# EAGLE design lt1619-breakout (EAGLE 6.2)
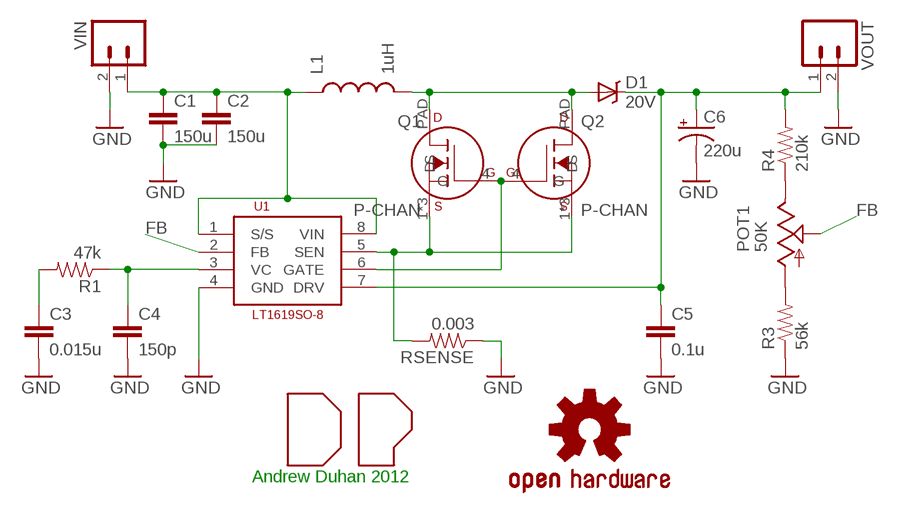
[diagram p0: schematic, sheet 1]

## Parts
C1  150u  CAP1210  [1210]
C2  150u  CAP1210  [1210]
C3  0.015u  CAP0603-CAP  [0603-CAP]
C4  150p  CAP0603-CAP  [0603-CAP]
C5  0.1u  CAP0603-CAP  [0603-CAP]
C6  220u  CAP_POL7343  [EIA7343]
D1  20V  SCHOTTKYDO214AB  [DO-214AB]
L1  1uH  INDUCTOR-SMD-MED4  [INDUCTOR_10.9X10.0]
POT1  50K  POT3310Y-001  [POT-TOP-BOURNS]
Q1  P-CHAN  MOSFET_NP-S08  [LFPAK]
Q2  P-CHAN  MOSFET_NP-S08  [LFPAK]
R1  47k  RESISTOR0603-RES  [0603-RES]
R3  56k  RESISTOR0603-RES  [0603-RES]
R4  210k  RESISTOR0603-RES  [0603-RES]
RSENSE  0.003  RESISTOR1206  [1206]
U1  LT1619SO-8  [SOIC-08]
U$2  DP_LOGO  [DP_LOGO]
U$4  OSHW-LOGOM  [OSHW-LOGO-M]
VIN  M02PTH  [1X02]
VOUT  M02PTH  [1X02]

## Nets
DRAIN: D1.A L1.P$2 Q1.PAD(D) Q2.PAD(D)
FB: POT1.2(W) U1.2(FB)
GATE: Q1.4(G) Q2.4(G) U1.6(GATE)
GND: C1.2 C2.2 C3.2 C4.2 C5.2 C6.C(-) R3.1 RSENSE.1 U1.4(GND) VIN.2 VOUT.2
N$1: C3.1 R1.2
N$2: POT1.3(B) R4.1
N$5: C4.1 R1.1 U1.3(VC)
N$8: POT1.1(A) R3.2
SOURCE: Q1.1(S) Q1.2(S) Q1.3(S) Q2.1(S) Q2.2(S) Q2.3(S) RSENSE.2 U1.5(SEN)
VBATT: C1.1 C2.1 L1.P$1 U1.1(S/S) U1.8(VIN) VIN.1
VOUT: C5.1 C6.A(+) D1.C R4.2 U1.7(DRV) VOUT.1

## Notes on the sheet
- Andrew Duhan 2012

## Library data of the parts
C1 C2 = SparkFun-Passives:CAP: Capacitor Standard 0603 ceramic capacitor, and 0.1" leaded capacitor.
C3-C5 = SparkFun:CAP: Capacitor Standard 0603 ceramic capacitor, and 0.1" leaded capacitor.
C6 = SparkFun-Passives:CAP_POL: Capacitor Polarized These are standard SMD and PTH capacitors. Normally 10uF, 47uF, and 100uF in electrolytic and tantalum varieties. Always verify the external diameter of the through hole cap, it varies with capacity, voltage, and manufacturer. The EIA devices should be standard.
D1 = myparts:SCHOTTKY
L1 = myparts:INDUCTOR-SMD-MED
POT1 = myparts:POT
Q1 Q2 = myparts:MOSFET_N
R1 R3 R4 RSENSE = SparkFun-Passives:RESISTOR: Resistor Basic schematic elements and footprints for 0603, 1206, and PTH resistors.
U1 = myparts:LT1619
U$2 = myparts:DP_LOGO: Duhan Power! logo
U$4 = SparkFun-Aesthetics:OSHW-LOGO: Open Source Hardware Logo This logo indicates the piece of hardware it is found on incorporates a OSHW license and/or adheres to the definition of open source hardware found here: http://freedomdefined.org/OSHW
VIN VOUT = SparkFun-Connectors:M02: Header 2 Standard 2-pin 0.1" header. Use with straight break away headers (SKU : PRT-00116), right angle break away headers (PRT-00553), swiss pins (PRT-00743), machine pins (PRT-00117), and female headers (PRT-00115). Molex polarized connector foot print use with SKU : PRT-08233 with associated crimp pins and housings.

## Board
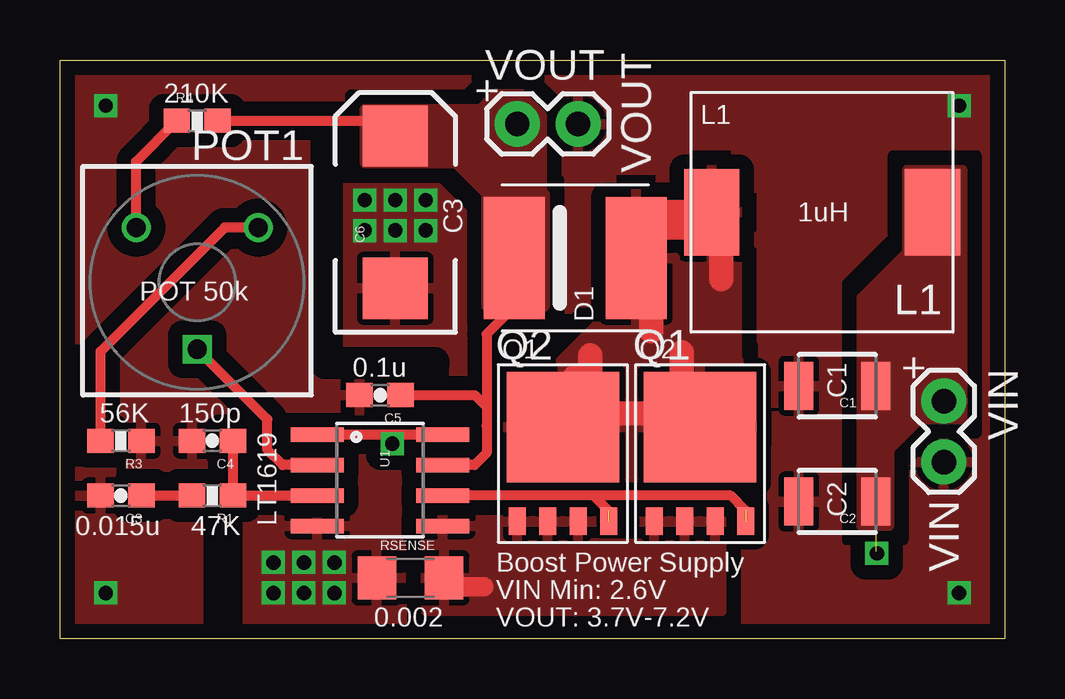
[diagram p1: board, top side]
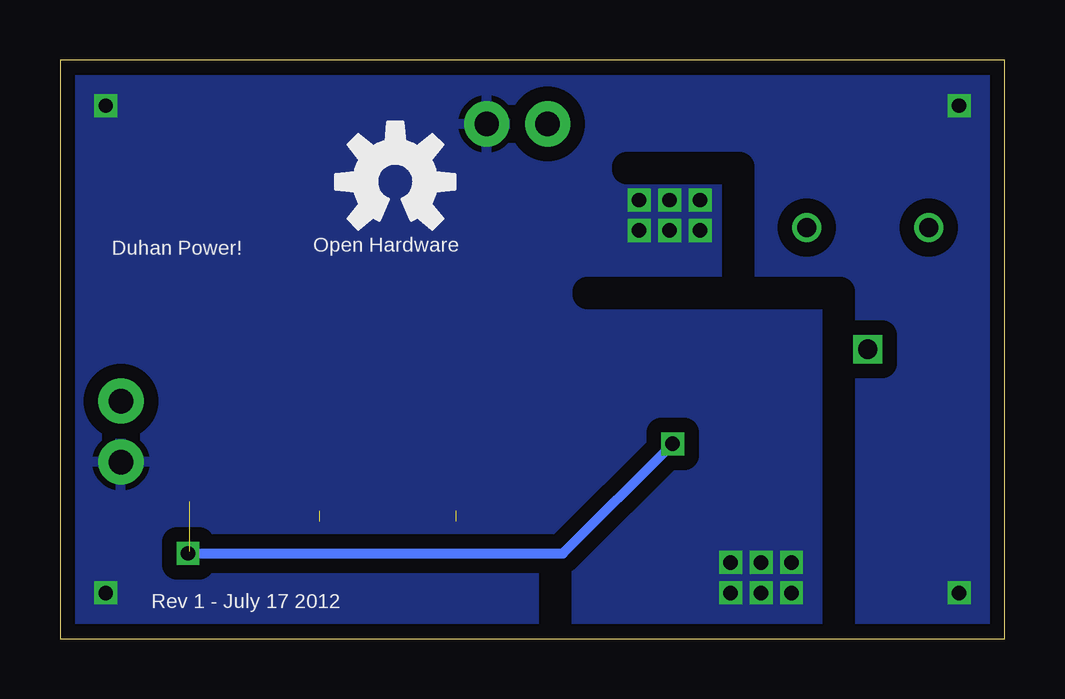
[diagram p2: board, bottom side, seen from below]

Size 39.37 x 24.13 mm. Coordinates in mm from the lower left corner, seen from the top.
Outline: 0,0 0,24.13 39.37,24.13 39.37,0 0,0
Copper layers (1*16): Top 0.0356mm / dielectric 1.5011mm / Bottom 0.0356mm
Design rules: minimum track width 6mil, minimum drill 13mil, track to track 6mil, track to pad 6mil, pad to pad 6mil, via to via 6mil, smd to smd 6mil, copper to edge 15mil, drill to drill 6mil, minimum pad ring 7mil, minimum via ring 7mil, stop-mask expansion 4mil, vias tented up to drill 24mil, thermal gap 10mil
tRestrict: area 11,11.4 to 15.6,21; area 6.6,1 to 7,4.8; area 23.4,4.2 to 24.1,5.5
bRestrict: area 6.9,0.6 to 17.4,14.5; area 11,14.4 to 15.7,19.7; area 18.7,0.6 to 18.8,3.2

### Footprints (pad centres in the part's own frame; a part is rotated, then mirrored left to right if it is on the bottom)
1210 = smd 1.2 x 2: 1 -1.6,0; 2 1.6,0
0603-CAP = smd 1.1 x 1: 1 -0.85,0; 2 0.85,0
EIA7343 = smd 2.55 x 2.7: A 3.17,0; C -3.17,0
DO-214AB = smd 2.54 x 5.08: A -2.54,0; C 2.54,0
INDUCTOR_10.9X10.0 = smd 2.3 x 3.6: P$1 -4.6,0; P$2 4.6,0
POT-TOP-BOURNS = drill 0.8: 1 -2.54,0; 3 2.54,0 | drill 0.8 square: 2 0,5.08
LFPAK = smd 0.7 x 1.15: 1 -1.905,-2.725; 2 -0.635,-2.725; 3 0.635,-2.725; 4 1.905,-2.725 | smd 4.7 x 4.6: PAD 0,1.2
0603-RES = smd 1.1 x 1: 1 -0.85,0; 2 0.85,0
1206 = smd 1.6 x 1.8: 1 -1.4,0; 2 1.4,0
SOIC-08 = smd 0.61 x 2.21: 1 -1.905,-2.616; 2 -0.635,-2.616; 3 0.635,-2.616; 4 1.905,-2.616; 5 1.905,2.616; 6 0.635,2.616; 7 -0.635,2.616; 8 -1.905,2.616
1X02 = drill 1.016 pad 1.88: 1 0,0; 2 2.54,0

### Placement (x,y rotation side)
C1  32.38,10.54 180 top
C2  32.38,5.71 180 top
C3  2.54,5.97 180 top
C4  6.35,8.26 180 top
C5  13.34,10.16 180 top
C6  13.97,17.78 90 top
D1  21.46,15.88 180 top
L1  31.75,17.78 180 top
POT1  5.71,17.14 180 top
Q1  26.67,7.62 0 top
Q2  20.95,7.62 0 top
R1  6.35,5.97 180 top
R3  2.54,8.26 180 top
R4  5.71,21.59 0 top
RSENSE  14.61,2.54 0 top
U1  13.34,6.6 270 top
U$2  34.29,19.18 0 bottom
U$4  25.4,19.05 0 bottom
VIN  36.83,9.91 270 top
VOUT  19.05,21.46 0 top

### Tracks (layer width: path | path; a pad name or v marks a point on that pad's centre or on a via)
DRAIN
  Top 0.813: 22.1,10.92 22.1,10.29 22.99,9.4
  Top 1.016: 25.91,11.94 25.91,10.79 | 22.1,11.81 22.1,10.92 21.46,10.92 | 24.64,12.83 24.64,13.84 24.51,13.97 | 27.56,14.99 27.56,16.51 | 24.77,9.4 22.99,9.4 | 24.13,17.78 27.18,17.78 27.18,17.14 24.26,17.14
  pour Top: 18.67,11.18 20.45,11.18 22.99,13.72 22.99,18.54 25.02,18.54 26.04,19.56 28.19,19.56 28.19,11.68 28.83,11.05 28.83,6.73 18.67,6.73
FB
  Top 0.406: U1.2 9.27,7.24 8.64,7.87 8.64,9.14 POT1.2
GATE  (2 unrouted)
  Top 0.406: 22.86,5.33 22.23,5.97 | 22.23,5.97 U1.6 | 28.57,5.33 27.94,5.97 22.23,5.97
GND  (via drill 0.6)
  other vias: 12.7,18.29 13.97,18.29 15.24,18.29 15.24,17.02 13.97,17.02 12.7,17.02 10.16,3.17 11.43,3.17 10.16,1.91 11.43,1.91 8.89,3.17 8.89,1.91 1.91,22.23 1.91,1.91 37.47,22.23 37.47,1.91
  pour Top (isolate 0.61, rank 3): 0,0 0,24.13 39.37,24.13 39.37,0
  pour Bottom (isolate 0.61, rank 3): 0,0 0,24.13 39.37,24.13 39.37,0
N$1
  Top 0.406: C3.1 R1.2
N$2
  Top 0.406: POT1.3 3.17,19.9 R4.1
N$5
  Top 0.406: C4.1 R1.1 U1.3
N$8
  Top 0.406: POT1.1 6.86,17.14 1.69,11.98 R3.2
SOURCE
  Top 0.813: 16,2.16 17.65,2.16
  pour Top: 15.24,1.14 15.24,4.95 27.56,4.95 27.56,1.14
VBATT  (via drill 0.6)  (1 unrouted)
  Top 0.406: U1.1 13.84,8.51 | 13.84,8.51 U1.8 | v13.84,8.13 13.84,8.51 | 33.98,3.63 v34.04,3.56
  Bottom 0.406: v34.04,3.56 18.41,3.56 v13.84,8.13
  pour Top (no thermals): 33.4,4.7 33.4,14.22 35.31,16.13 35.31,19.56 37.59,19.56 37.59,9.14 35.81,9.14 34.54,7.87 34.54,4.7
VOUT
  Top 0.406: 17.78,9.65 17.27,10.16 C5.1 15.24,10.16 | 17.78,9.65 17.78,8.89 17.78,7.75 17.27,7.24 U1.7 | 19.05,13.97 17.78,12.7 17.78,9.65 | R4.2 13.33,21.59 C6.A
  pour Top (no thermals): 17.78,13.84 17.78,18.54 16.51,19.81 12.7,19.81 12.7,22.1 17.53,22.1 18.16,22.73 19.18,22.73 20.07,21.84 20.07,18.67 20.19,18.54 20.19,13.84

### Text on the board
tPlace: 210K | + | L1 | VOUT | C3 | 1uH | POT 50k | D1 | Q1 | Q2 | 0.1u | + | C1 | 56K | 150p | LT1619 | C2 | 0.015u | 47K | Boost Power Supply | VIN | VIN Min: 2.6V | 0.002 | VOUT: 3.7V-7.2V
bPlace: Open Hardware | Duhan Power! | Rev 1 - July 17 2012